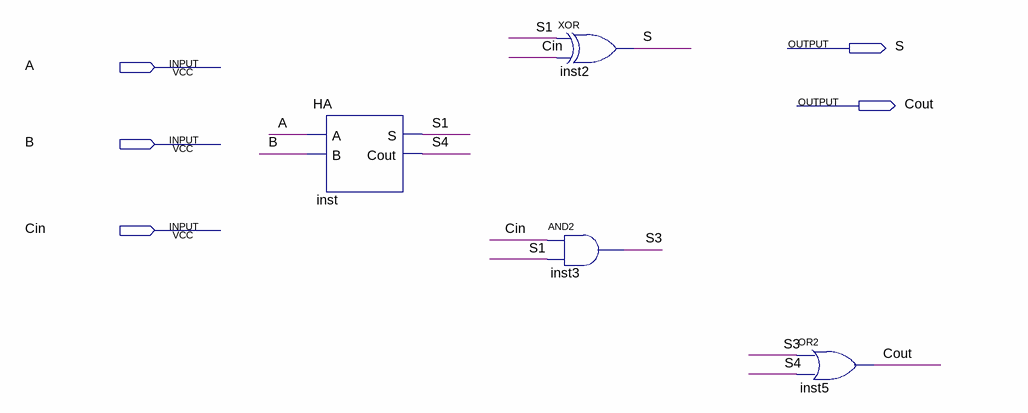
[diagram p0: schematic sheet]
// Quartus schematic FA.bdf as structural Verilog: 4 symbols, 5 pins
module FA (
  input  A,
  input  B,
  input  Cin,
  output S,
  output Cout
);

  wire S1, S3, S4;

  HA inst (.A(A), .B(B), .S(S1), .Cout(S4));
  xor inst2 (S, S1, Cin);
  and inst3 (S3, Cin, S1);
  or inst5 (Cout, S3, S4);
endmodule
